# Altium schematic sheet Motor_Control.SchDoc
size 310 x 201 mm; SheetNumber: 6; SheetTotal: 7
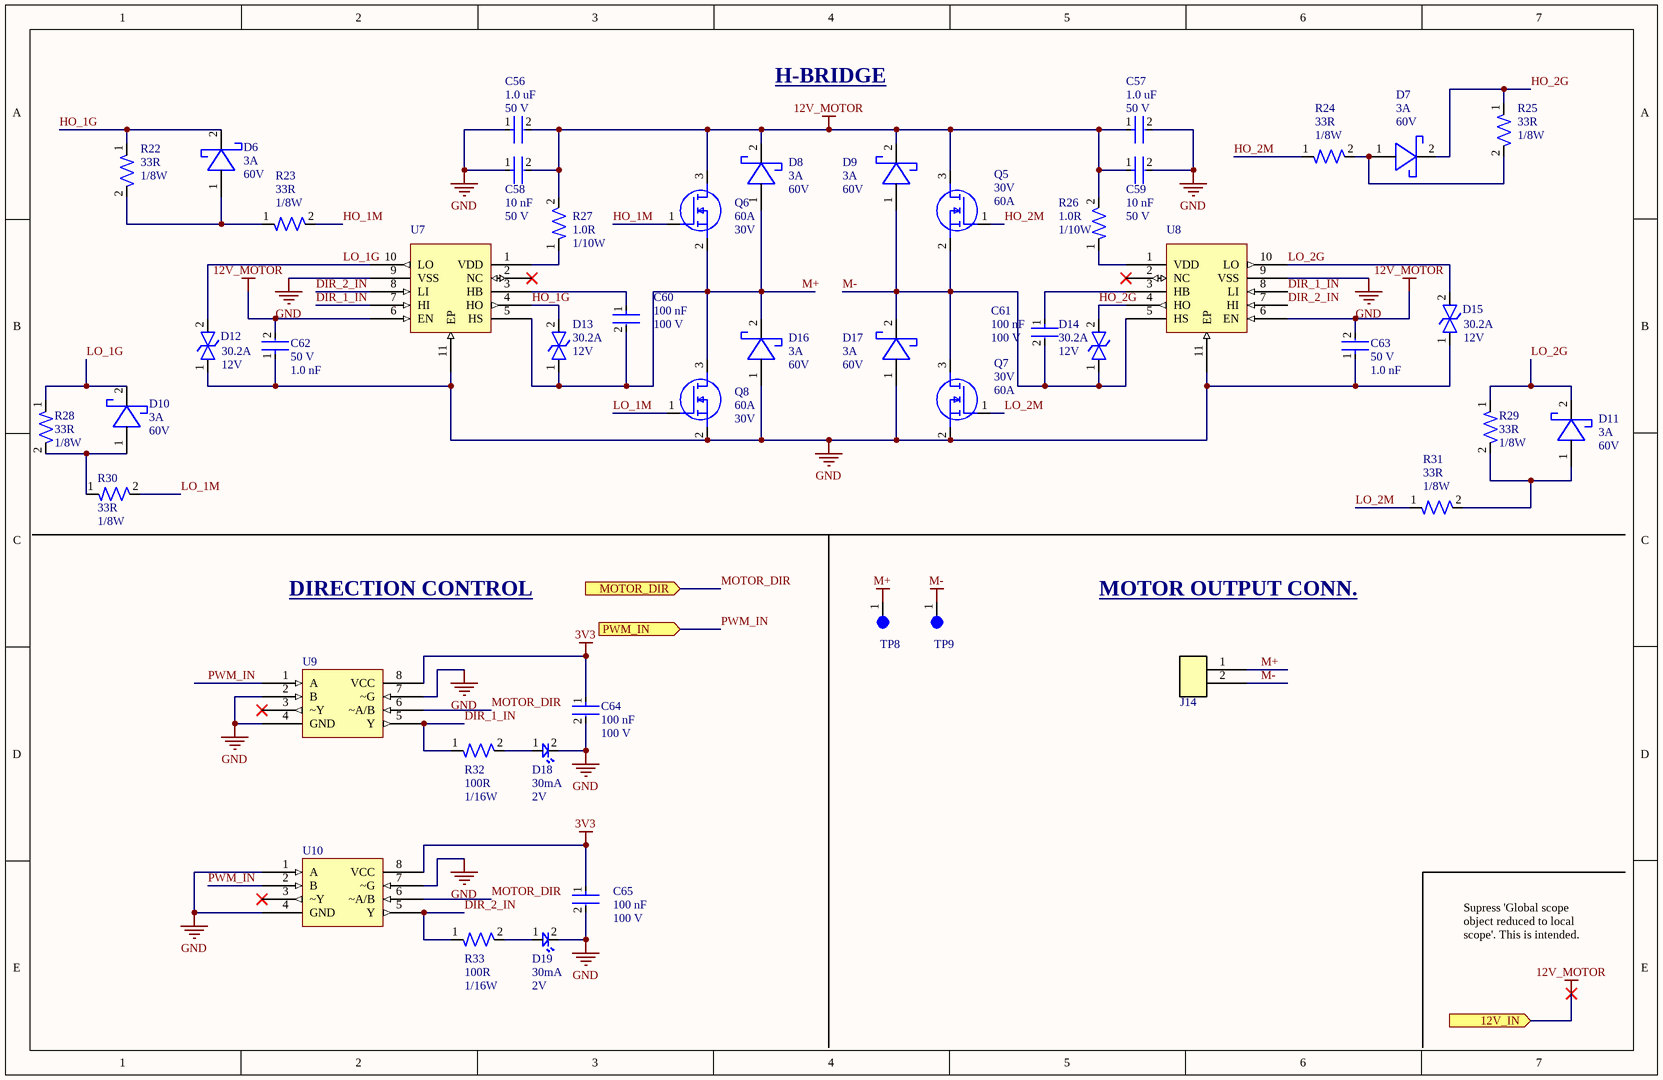
[diagram p0: Motor_Control.SchDoc]

## Parts
C56  Voltage: 50 V  Capacitance: 1.0 uF  [CAP-0805]  (hidden comment: CC0805KKX7R9BB105)
C57  Voltage: 50 V  Capacitance: 1.0 uF  [CAP-0805]  (hidden comment: CC0805KKX7R9BB105)
C58  Voltage: 50 V  Capacitance: 10 nF  [CAP-0603]  (hidden comment: CC0603KPX7R9BB103)
C59  Voltage: 50 V  Capacitance: 10 nF  [CAP-0603]  (hidden comment: CC0603KPX7R9BB103)
C60  Capacitance: 100 nF  Voltage: 100 V  [CAP-0603]  (hidden comment: CC0603KRX7R0BB104)
C61  Capacitance: 100 nF  Voltage: 100 V  [CAP-0603]  (hidden comment: CC0603KRX7R0BB104)
C62  Voltage: 50 V  Capacitance: 1.0 nF  [CAP-0402]  (hidden comment: CC0402KRX7R9BB102)
C63  Voltage: 50 V  Capacitance: 1.0 nF  [CAP-0402]  (hidden comment: CC0402KRX7R9BB102)
C64  Capacitance: 100 nF  Voltage: 100 V  [CAP-0603]  (hidden comment: CC0603KRX7R0BB104)
C65  Capacitance: 100 nF  Voltage: 100 V  [CAP-0603]  (hidden comment: CC0603KRX7R0BB104)
D6  Current Rating: 3A  Reverse Voltage: 60V  [DIO-SOD128]  (hidden comment: PMEG6030EP,115)
D7  Current Rating: 3A  Reverse Voltage: 60V  [DIO-SOD128]  (hidden comment: PMEG6030EP,115)
D8  Current Rating: 3A  Reverse Voltage: 60V  [DIO-SOD128]  (hidden comment: PMEG6030EP,115)
D9  Current Rating: 3A  Reverse Voltage: 60V  [DIO-SOD128]  (hidden comment: PMEG6030EP,115)
D10  Current Rating: 3A  Reverse Voltage: 60V  [DIO-SOD128]  (hidden comment: PMEG6030EP,115)
D11  Current Rating: 3A  Reverse Voltage: 60V  [DIO-SOD128]  (hidden comment: PMEG6030EP,115)
D12  Standoff Voltage: 12V  Current Rating: 30.2A  [DO-214AA (SMBJ)]  (hidden comment: SMBJ12CA)
D13  Standoff Voltage: 12V  Current Rating: 30.2A  [DO-214AA (SMBJ)]  (hidden comment: SMBJ12CA)
D14  Standoff Voltage: 12V  Current Rating: 30.2A  [DO-214AA (SMBJ)]  (hidden comment: SMBJ12CA)
D15  Standoff Voltage: 12V  Current Rating: 30.2A  [DO-214AA (SMBJ)]  (hidden comment: SMBJ12CA)
D16  Current Rating: 3A  Reverse Voltage: 60V  [DIO-SOD128]  (hidden comment: PMEG6030EP,115)
D17  Current Rating: 3A  Reverse Voltage: 60V  [DIO-SOD128]  (hidden comment: PMEG6030EP,115)
D18  Forward Current: 30mA  Forward Voltage: 2V  [LED-0603]  (hidden comment: BL-HKC36G-AV-TRB)
D19  Forward Current: 30mA  Forward Voltage: 2V  [LED-0603]  (hidden comment: BL-HKC36G-AV-TRB)
J14  0430450212  [CONN-2POS-0001]  (value not drawn)
Q5  Voltage: 30V  Continuous Current: 60A  [IC-8VSONCLIP]  (hidden comment: CSD17575Q3)
Q6  Voltage: 30V  Continuous Current: 60A  [IC-8VSONCLIP]  (hidden comment: CSD17575Q3)
Q7  Voltage: 30V  Continuous Current: 60A  [IC-8VSONCLIP]  (hidden comment: CSD17575Q3)
Q8  Voltage: 30V  Continuous Current: 60A  [IC-8VSONCLIP]  (hidden comment: CSD17575Q3)
R22  Resistance: 33R  Power: 1/8W  [RES-0402]  (hidden comment: RC0402FR-7W33RL)
R23  Resistance: 33R  Power: 1/8W  [RES-0402]  (hidden comment: RC0402FR-7W33RL)
R24  Resistance: 33R  Power: 1/8W  [RES-0402]  (hidden comment: RC0402FR-7W33RL)
R25  Resistance: 33R  Power: 1/8W  [RES-0402]  (hidden comment: RC0402FR-7W33RL)
R26  Resistance: 1.0R  Power: 1/10W  [RES-0402]  (hidden comment: ERJ2GEJ1R0X)
R27  Resistance: 1.0R  Power: 1/10W  [RES-0402]  (hidden comment: ERJ2GEJ1R0X)
R28  Resistance: 33R  Power: 1/8W  [RES-0402]  (hidden comment: RC0402FR-7W33RL)
R29  Resistance: 33R  Power: 1/8W  [RES-0402]  (hidden comment: RC0402FR-7W33RL)
R30  Resistance: 33R  Power: 1/8W  [RES-0402]  (hidden comment: RC0402FR-7W33RL)
R31  Resistance: 33R  Power: 1/8W  [RES-0402]  (hidden comment: RC0402FR-7W33RL)
R32  Power: 1/16W  Resistance: 100R  [RES-0402]  (hidden comment: RC0402FR-07100RL)
R33  Power: 1/16W  Resistance: 100R  [RES-0402]  (hidden comment: RC0402FR-07100RL)
TP8  5003  [TEST-POINT-0001]  (value not drawn)
TP9  5003  [TEST-POINT-0001]  (value not drawn)
U7  UCC27282DRCR  [IC-10VSON]  (value not drawn)
U8  UCC27282DRCR  [IC-10VSON]  (value not drawn)
U9  SN74LVC2G157DCUR  [IC-8VSSOP]  (value not drawn)
U10  SN74LVC2G157DCUR  [IC-8VSSOP]  (value not drawn)

## Ports
12V_IN (in, see TLD[4E]), MOTOR_DIR (in, see TLD[3E]), PWM_IN (in, see TLD[3D])

## Nets
3V3: C64.1 C65.1 U9.8(VCC) U10.8(VCC)
12V_MOTOR: C56.2 C57.1 C58.2 C59.1 C62.2 C63.2 D8.2(ANODE) D9.2(ANODE) Q5.3(D) Q6.3(D) R26.2 R27.2 U7.6(EN) U8.6(EN) ; port 12V_IN
GND: C56.1 C57.2 C58.1 C59.2 C62.1 C63.1 C64.2 C65.2 D12.1 D15.1 D16.1(CATHODE) D17.1(CATHODE) D18.2 D19.2 Q7.2(S) Q8.2(S) U7.9(VSS) U7.11(EP) U8.9(VSS) U8.11(EP) U9.2(B) U9.4(GND) U9.7(~G) U10.1(A) U10.4(GND) U10.7(~G)
M+: C60.2 D8.1(CATHODE) D13.1 D16.2(ANODE) J14.1 Q6.2(S) Q8.3(D) TP8.1 U7.5(HS)
M-: C61.2 D9.1(CATHODE) D14.1 D17.2(ANODE) J14.2 Q5.2(S) Q7.3(D) TP9.1 U8.5(HS)
DIR_1_IN: R32.1 U7.7(HI) U8.8(LI) U9.5(Y)
DIR_2_IN: R33.1 U7.8(LI) U8.7(HI) U10.5(Y)
HO_1G: D6.2(ANODE) D13.2 R22.1 U7.4(HO)
HO_1M: Q6.1(G) R23.2
HO_2G: D7.2(ANODE) D14.2 R25.1 U8.4(HO)
HO_2M: Q5.1(G) R24.1
LO_1G: D10.2(ANODE) D12.2 R28.1 U7.10(LO)
LO_1M: Q8.1(G) R30.2
LO_2G: D11.2(ANODE) D15.2 R29.1 U8.10(LO)
LO_2M: Q7.1(G) R31.1
MOTOR_DIR: U9.6(~A/B) U10.6(~A/B) ; port MOTOR_DIR
PWM_IN: U9.1(A) U10.2(B) ; port PWM_IN
NetC60_1: C60.1 U7.3(HB)
NetC61_1: C61.1 U8.3(HB)
NetD6_1: D6.1(CATHODE) R22.2 R23.1
NetD7_1: D7.1(CATHODE) R24.2 R25.2
NetD10_1: D10.1(CATHODE) R28.2 R30.1
NetD11_1: D11.1(CATHODE) R29.2 R31.2
NetD18_1: D18.1 R32.2
NetD19_1: D19.1 R33.2
NetR26_1: R26.1 U8.1(VDD)
NetR27_1: R27.1 U7.1(VDD)

Not connected (* = marked no-connect by the designer): U7 2(NC)*; U8 2(NC)*; U9 3(~Y)*; U10 3(~Y)*

## Notes on the sheet
- H-BRIDGE
- DIRECTION CONTROL
- MOTOR OUTPUT CONN.
- Supress 'Global scope object reduced to local scope'. This is intended.

## Library data of the parts
C56 C57 = CAP-1U-0001: CAP CER 1UF 50V X7R 0805; ComponentLink2URL: https://www.yageo.com/upload/media/product/productsearch/datasheet/mlcc/UPY-GPHC_X7R_6.3V-to-250V_24.pdf; ComponentLink2Description: Datasheet; Device Class: Ceramic; Size: 0805
C58 C59 = CAP-10N-0002: CAP CER 10000PF 50V X7R 0603; ComponentLink2Description: Datasheet; ComponentLink2URL: http://www.yageo.com/documents/recent/UPY-GPHC_X7R_6.3V-to-50V_18.pdf; Device Class: Ceramic; Size: 0603
C60 C61 C64 C65 = CAP-100N-0001: CAP CER 0.1UF 100V X7R 0603; Device Class: Ceramic; Size: 0603; ComponentLink1Description: Datasheet; ComponentLink1URL: https://www.yageo.com/upload/media/product/app/datasheet/mlcc/upy-np0x7r_mv_100-to-630v.pdf
C62 C63 = CAP-1N-0001: CAP CER 1000PF 50V X7R 0402; ComponentLink2Description: Datasheet; ComponentLink2URL: http://www.yageo.com/documents/recent/UPY-GP_NP0_16V-to-50V_16.pdf; Device Class: Ceramic; Size: 0402
D6-D11 D16 D17 = DIO-SCHOTTKY-0003: DIODE SCHOTTKY 60V 3A SOD128; ComponentLink1Description: Datasheet; ComponentLink1URL: https://assets.nexperia.com/documents/data-sheet/PMEG6030EP.pdf
D12-D15 = DIO-TVS-0002: TVS DIODE 12VWM 19.9VC DO214AA; ComponentLink1Description: Datasheet; ComponentLink1URL: https://www.littelfuse.com/media?resourcetype=datasheets&itemid=09a6ae9a-73cb-4ac4-acac-e6dab92ab953&filename=littelfuse_tvs_diode_smbj_datasheet.pdf
D18 D19 = LED-0001: LED YELLOW CLEAR 0603 SMD; ComponentLink1Description: Datasheet; ComponentLink1URL: https://www.americanbrightled.com/pdffiles/led-components/smt/BL-HKC36G-AV-TRB.pdf
J14 = CONN-2POS-0001: CONN HEADER VERT 2POS; ComponentLink1Description: Datasheet; ComponentLink1URL: https://tools.molex.com/pdm_docs/ps/PS-43045.pdf
Q5-Q8 = NMOS-26A-0001: MOSFET N-CH 30V 60A 8VSON; ComponentLink1Description: Datasheet; ComponentLink1URL: https://www.ti.com/lit/ds/symlink/csd17575q3.pdf?ts=1728565072242&ref_url=https%253A%252F%252Fwww.mouser.co.uk%252F
R22-R25 R28-R31 = RES-33-0001: RES 33 OHM 1% 1/8W 0402; Tolerance: 1%; Size: 0402; ComponentLink1Description: Datasheet; ComponentLink1URL: https://www.yageo.com/upload/media/product/products/datasheet/rchip/PYu-RC_Group_51_RoHS_L_12.pdf
R26 R27 = RES-1-0001: RES SMD 1 OHM 5% 1/10W 0402; Tolerance: 5%; ComponentLink1Description: Datasheet; ComponentLink1URL: https://api.pim.na.industrial.panasonic.com/file_stream/main/fileversion/1242; Size: 0402
R32 R33 = RES-100-0001: RES 100 OHM 1% 1/16W 0402; Tolerance: 1%; Size: 0402; ComponentLink1Description: Datasheet; ComponentLink1URL: https://www.yageo.com/upload/media/product/products/datasheet/rchip/PYu-RC_Group_51_RoHS_L_12.pdf
TP8 TP9 = TEST-POINT-0001: Oranange PC Test Point, Miniature Phoisphor Bronze Silver Plating Through Hole Mounting Type
U7 U8 = IC-GTDR-0001: IC GATE DRVR HALF-BRIDGE 10VSON; VCC Max: 16; Package: 10-VSON; ComponentLink1Description: Datasheet; ComponentLink1URL: https://www.ti.com/lit/ds/symlink/ucc27282.pdf?HQS=dis-dk-null-digikeymode-dsf-pf-null-wwe&ts=1728563165008&ref_url=https%253A%252F%252Fwww.ti.com
U9 U10 = IC-MUX-0001: Multiplexer 1 x 2:1 8-VSSOP; ComponentLink1Description: Datasheet; ComponentLink1URL: https://www.ti.com/general/docs/suppproductinfo.tsp?distId=10&gotoUrl=https%3A%2F%2Fwww.ti.com%2Flit%2Fgpn%2Fsn74lvc2g157